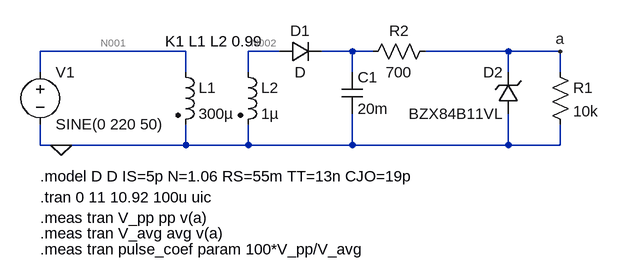
[diagram p0: schematic 1.7.asc]
1.7.asc, the LTspice schematic file:
Version 4
SHEET 1 1076 680
WIRE 320 80 96 80
WIRE 464 80 416 80
WIRE 576 80 528 80
WIRE 608 80 576 80
WIRE 816 80 688 80
WIRE 896 80 816 80
WIRE 96 112 96 80
WIRE 320 112 320 80
WIRE 416 112 416 80
WIRE 576 112 576 80
WIRE 816 112 816 80
WIRE 896 112 896 80
WIRE 96 224 96 192
WIRE 128 224 96 224
WIRE 320 224 320 192
WIRE 320 224 128 224
WIRE 416 224 416 192
WIRE 416 224 320 224
WIRE 576 224 576 176
WIRE 576 224 416 224
WIRE 816 224 816 176
WIRE 816 224 576 224
WIRE 896 224 896 192
WIRE 896 224 816 224
FLAG 128 224 0
FLAG 896 80 a
SYMBOL voltage 96 96 R0
WINDOW 123 0 0 Left 0
WINDOW 39 0 0 Left 0
SYMATTR InstName V1
SYMATTR Value SINE(0 220 50)
SYMBOL ind2 304 96 R0
SYMATTR InstName L1
SYMATTR Value 300µ
SYMATTR SpiceLine Rser=10m
SYMATTR Type ind
SYMBOL ind2 400 96 R0
SYMATTR InstName L2
SYMATTR Value 1µ
SYMATTR SpiceLine Rser=10m
SYMATTR Type ind
SYMBOL diode 464 96 R270
WINDOW 0 32 32 VTop 2
WINDOW 3 0 32 VBottom 2
SYMATTR InstName D1
SYMBOL cap 560 112 R0
SYMATTR InstName C1
SYMATTR Value 20m
SYMBOL res 880 96 R0
SYMATTR InstName R1
SYMATTR Value 10k
SYMBOL res 704 64 R90
WINDOW 0 0 56 VBottom 2
WINDOW 3 32 56 VTop 2
SYMATTR InstName R2
SYMATTR Value 700
SYMBOL zener 832 176 R180
WINDOW 0 24 64 Left 2
WINDOW 3 24 0 Left 2
SYMATTR InstName D2
SYMATTR Value BZX84B11VL
SYMATTR Description Diode
SYMATTR Type diode
TEXT 96 272 Left 2 !.model D D IS=5p N=1.06 RS=55m TT=13n CJO=19p
TEXT 96 304 Left 2 !.tran 0 11 10.92 100u uic
TEXT 96 336 Left 2 !.meas tran V_pp pp v(a)
TEXT 96 360 Left 2 !.meas tran V_avg avg v(a)
TEXT 96 384 Left 2 !.meas tran pulse_coef param 100*V_pp/V_avg
TEXT 288 64 Left 2 !K1 L1 L2 0.99

The netlist it stands for:
* 1.7.asc
V1 N001 0 SINE(0 220 50)
L1 N001 0 300µ Rser=10m
L2 N002 0 1µ Rser=10m
D1 N002 N003 D
C1 N003 0 20m
R1 a 0 10k
R2 a N003 700
D2 0 a BZX84B11VL
.model D D
.lib standard.dio
.model D D IS=5p N=1.06 RS=55m TT=13n CJO=19p
.tran 0 11 10.92 100u uic
.meas tran V_pp pp v(a)
.meas tran V_avg avg v(a)
.meas tran pulse_coef param 100*V_pp/V_avg
K1 L1 L2 0.99
.backanno
.end

* Results of the author's LTspice run, read from the files saved beside the schematic
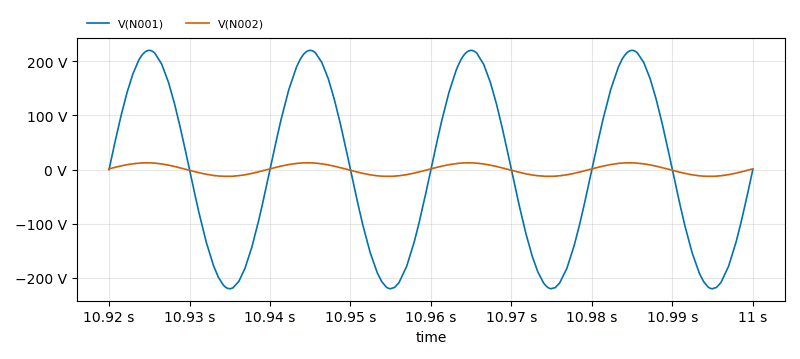
[diagram p1: Transient Analysis of 1.7.asc, plotted from the saved traces]
* Transient Analysis, 1 run:
*   V(N001): min -220 V, max 220 V, average 51.12 mV, rms 155.6 V, last 0 V
*   V(N002): min -12.5 V, max 12.5 V, average 2.947 mV, rms 8.84 V, last 1.319 V
* From the log:
*   v_pp: PP(v(a))=6.38962e-005 FROM 0 TO 0.08
*   v_avg: AVG(v(a))=10.978 FROM 0 TO 0.08
*   pulse_coef: 100*v_pp/v_avg=0.000582039